# EAGLE schematic gondola (EAGLE 8.3.2)
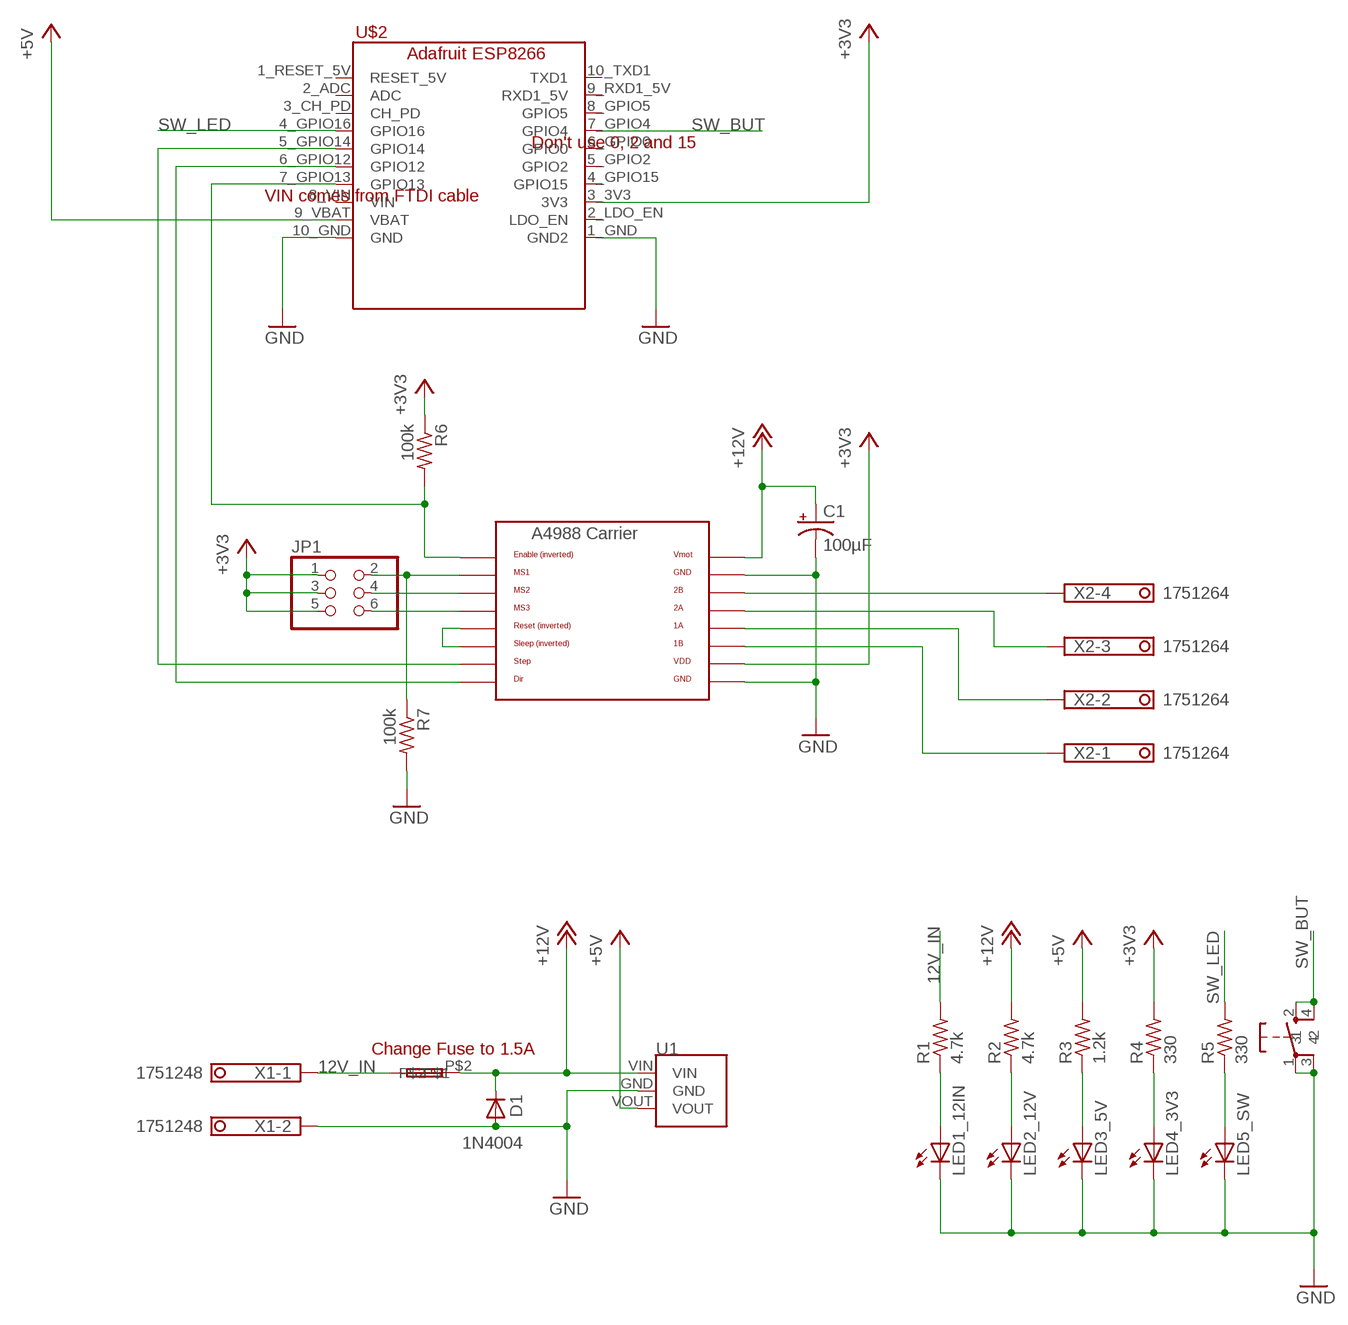
[diagram p0: schematic, sheet 1]

## Parts
C1  100µF  CPOL-US153CLV-0605  [153CLV-0605]
D1  1N4004  [DO41-10]
F1  MFR500  [MFR500]
JP1  PINHD-2X3  [2X03]
LED1_12IN  LEDCHIP-LED0805  [CHIP-LED0805]
LED2_12V  LEDCHIP-LED0805  [CHIP-LED0805]
LED3_5V  LEDCHIP-LED0805  [CHIP-LED0805]
LED4_3V3  LEDCHIP-LED0805  [CHIP-LED0805]
LED5_SW  LEDCHIP-LED0805  [CHIP-LED0805]
R1  4.7k  R-US_R0805  [R0805]
R2  4.7k  R-US_R0805  [R0805]
R3  1.2k  R-US_R0805  [R0805]
R4  330  R-US_R0805  [R0805]
R5  330  R-US_R0805  [R0805]
R6  100k  R-US_R0805  [R0805]
R7  100k  R-US_R0805  [R0805]
U1  ROHM_BP5293-XX  [ROHM_BP5293-XX]
U$1  A4988BREAKOUT  [A4988BREAKOUT]
U$2  ADAFRUIT_ESP8266  [ADAFRUIT_ESP8266]
U$4  FSMCTTR  [FSMCTTR]
X1  1751248  [1751248]
X2  1751264  [1751264]

## Nets
1A: U$1.1A X2.2
1B: U$1.1B X2.1
2A: U$1.2A X2.3
2B: U$1.2B X2.4
12V_IN: F1.P$1 R1.2 X1.1
!RESET: U$1.RST U$1.SLP(SLEEP)
+3V3: JP1.1 JP1.3 JP1.5 R4.2 R6.1 U$1.VDD U$2.3_3V3(3V3)
+5V: R3.2 U1.VOUT U$2.9_VBAT(VBAT)
+12V: C1.+ D1.C F1.P$2 R2.2 U1.VIN U$1.VMOT
DIR: U$1.STEP U$2.5_GPIO14(GPIO14)
GND: C1.- D1.A LED1_12IN.C LED2_12V.C LED3_5V.C LED4_3V3.C LED5_SW.C R7.2 U1.GND U$1.GND U$1.GND@0(GND) U$2.1_GND(GND2) U$2.10_GND(GND) U$4.1 U$4.3 X1.2
M_EN: R6.2 U$1.EN U$2.7_GPIO13(GPIO13)
MS1: JP1.2 R7.1 U$1.MS1
MS2: JP1.4 U$1.MS2
MS3: JP1.6 U$1.MS3
N$1: LED2_12V.A R2.1
N$2: LED1_12IN.A R1.1
N$8: LED4_3V3.A R4.1
N$18: LED5_SW.A R5.1
N$19: LED3_5V.A R3.1
STEP: U$1.DIR U$2.6_GPIO12(GPIO12)
SW_BUT: U$2.7_GPIO4(GPIO4) U$4.2 U$4.4
SW_LED: R5.2 U$2.4_GPIO16(GPIO16)
Unconnected: U$2.1_RESET_5V(RESET_5V) U$2.2_ADC(ADC) U$2.2_LDO_EN(LDO_EN) U$2.3_CH_PD(CH_PD) U$2.4_GPIO15(GPIO15) U$2.5_GPIO2(GPIO2) U$2.6_GPIO0(GPIO0) U$2.8_GPIO5(GPIO5) U$2.8_VIN(VIN) U$2.9_RXD1_5V(RXD1_5V) U$2.10_TXD1(TXD1)

## Notes on the sheet
- Don't use 0, 2 and 15
- VIN comes from FTDI cable
- Change Fuse to 1.5A

## Library data of the parts
C1 = adafruit:CPOL-US: POLARIZED CAPACITOR, American symbol
D1 = diode:1N4004: DIODE general purpose rectifier, 1 A
F1 = MS:MFR500
JP1 = pinhead:PINHD-2X3: PIN HEADER
LED1_12IN LED2_12V LED3_5V LED4_3V3 LED5_SW = led:LED: LED OSRAM: - CHIPLED LG R971, LG N971, LY N971, LG Q971, LY Q971, LO R971, LY R971 LH N974, LH R974 LS Q976, LO Q976, LY Q976 LO Q996 - Hyper CHIPLED LW Q18S LB Q993, LB Q99A, LB R99A - SideLED LS A670, LO A670, LY A670, LG A670, LP A670 LB A673, LV A673, LT A673, LW A673 LH A674 LY A675 LS A676, LA A676, LO A676, LY A676, LW A676 LS A679, LY A679, LG A679 - Hyper Micro SIDELED® LS Y876, LA Y876, LO Y876, LY Y876 LT Y87S - SmartLED LW L88C, LW L88S LB L89C, LB L89S, LG L890 LS L89K, LO L89K, LY L89K LS L896, LA L896, LO L896, LY L896 - TOPLED LS T670, LO T670, LY T670, LG T670, LP T670 LSG T670, LSP T670, LSY T670, LOP T670, LYG T670 LG T671, LOG T671, LSG T671 LB T673, LV T673, LT T673, LW T673 LH T674 LS T676, LA T676, LO T676, LY T676, LB T676, LH T676, LSB T676, LW T676 LB T67C, LV T67C, LT T67C, LS T67K, LO T67K, LY T67K, LW E67C LS E67B, LA E67B, LO E67B, LY E67B, LB E67C, LV E67C, LT E67C LW T67C LS T679, LY T679, LG T679 LS T770, LO T770, LY T770, LG T770, LP T770 LB T773, LV T773, LT T773, LW T773 LH T774 LS E675, LA E675, LY E675, LS T675 LS T776, LA T776, LO T776, LY T776, LB T776 LHGB T686 LT T68C, LB T68C - Hyper Mini TOPLED® LB M676 - Mini TOPLED Santana® LG M470 LS M47K, LO M47K, LY M47K Source: http://www.osram.convergy.de LUXEON: - LUMILED® LXK2-PW12-R00, LXK2-PW12-S00, LXK2-PW14-U00, LXK2-PW14-V00 LXK2-PM12-R00, LXK2-PM12-S00, LXK2-PM14-U00 LXK2-PE12-Q00, LXK2-PE12-R00, LXK2-PE12-S00, LXK2-PE14-T00, LXK2-PE14-U00 LXK2-PB12-K00, LXK2-PB12-L00, LXK2-PB12-M00, LXK2-PB14-N00, LXK2-PB14-P00, LXK2-PB14-Q00 LXK2-PR12-L00, LXK2-PR12-M00, LXK2-PR14-Q00, LXK2-PR14-R00 LXK2-PD12-Q00, LXK2-PD12-R00, LXK2-PD12-S00 LXK2-PH12-R00, LXK2-PH12-S00 LXK2-PL12-P00, LXK2-PL12-Q00, LXK2-PL12-R00 Source: www.luxeon.com KINGBRIGHT: KA-3528ASYC Source: www.kingbright.com
R1-R7 = adafruit:R-US_: RESISTOR, American symbol
U1 = MS:ROHM_BP5293-XX
U$1 = RepRapjr:A4988BREAKOUT
U$2 = MS:ADAFRUIT_ESP8266
U$4 = MS:FSMCTTR
X1 = con-phoenix-350:1751248: MKDS 1/ 2-3,5 Printklemme Nennstrom: 10 A Bemessungsspannung: 160 V Raster: 3,5 mm Polzahl: 2 Montageart: Löten Anschlussart: Schraubanschluss Anschlussrichtung vom Leiter zur Platine: 0° Source: http://eshop.phoenixcontact.com .. 1751248.pdf; OC_FARNELL: unknown; OC_NEWARK: unknown
X2 = con-phoenix-350:1751264: MKDS 1/ 4-3,5 Printklemme Nennstrom: 10 A Bemessungsspannung: 160 V Raster: 3,5 mm Polzahl: 4 Montageart: Löten Anschlussart: Schraubanschluss Anschlussrichtung vom Leiter zur Platine: 0° Source: http://eshop.phoenixcontact.com .. 1751264.pdf; MPN: 1751264; OC_FARNELL: unknown; OC_NEWARK: 10R0934